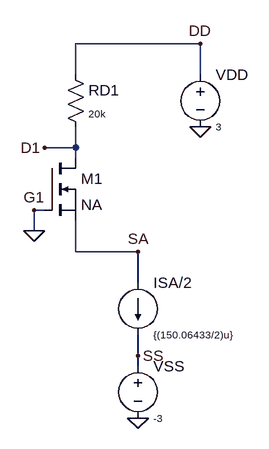
[diagram p0: schematic DifferentialAmplifierStaticConditionsDIffAmp.asc]
DifferentialAmplifierStaticConditionsDIffAmp.asc, the LTspice schematic file:
Version 4
SHEET 1 880 680
WIRE 448 -80 256 -80
WIRE 256 -32 256 -80
WIRE 448 -32 448 -80
WIRE 256 80 256 48
WIRE 256 80 208 80
WIRE 256 96 256 80
WIRE 208 176 192 176
WIRE 192 208 192 176
WIRE 256 240 256 192
WIRE 352 240 256 240
WIRE 352 288 352 240
WIRE 352 400 352 368
WIRE 352 416 352 400
FLAG 352 240 SA
FLAG 208 80 D1
FLAG 192 208 0
FLAG 192 176 G1
FLAG 448 48 0
FLAG 352 496 0
FLAG 448 -80 DD
FLAG 352 400 SS
SYMBOL nmos 208 96 R0
SYMATTR InstName M1
SYMATTR Value NA
SYMBOL res 240 -48 R0
WINDOW 3 36 76 Left 1
SYMATTR Value 20k
SYMATTR InstName RD1
SYMBOL voltage 448 -48 R0
WINDOW 3 24 96 Left 1
SYMATTR Value 3
SYMATTR InstName VDD
SYMBOL current 352 288 R0
WINDOW 3 24 80 Left 1
SYMATTR Value {(150.06433/2)u}
SYMATTR InstName ISA/2
SYMBOL voltage 352 400 R0
WINDOW 3 24 96 Left 1
SYMATTR Value -3
SYMATTR InstName VSS

The netlist it stands for:
* DifferentialAmplifierStaticConditionsDIffAmp.asc
M1 D1 0 SA SA NA
RD1 DD D1 20k
VDD DD 0 3
ISA/2 SA SS {(150.06433/2)u}
VSS SS 0 -3
.model NMOS NMOS
.model PMOS PMOS
.lib standard.mos
.backanno
.end